# Altium project MB1635.PrjPcb (part 3 of 4)

## Sheet USB_TypeC_DRP.SchDoc: USB Type-C DRP
size A3; DocumentNumber: 13; Revision: A-01; SheetNumber: 13; SheetTotal: 17; Project: STM32MP15-BATTERY BOARD
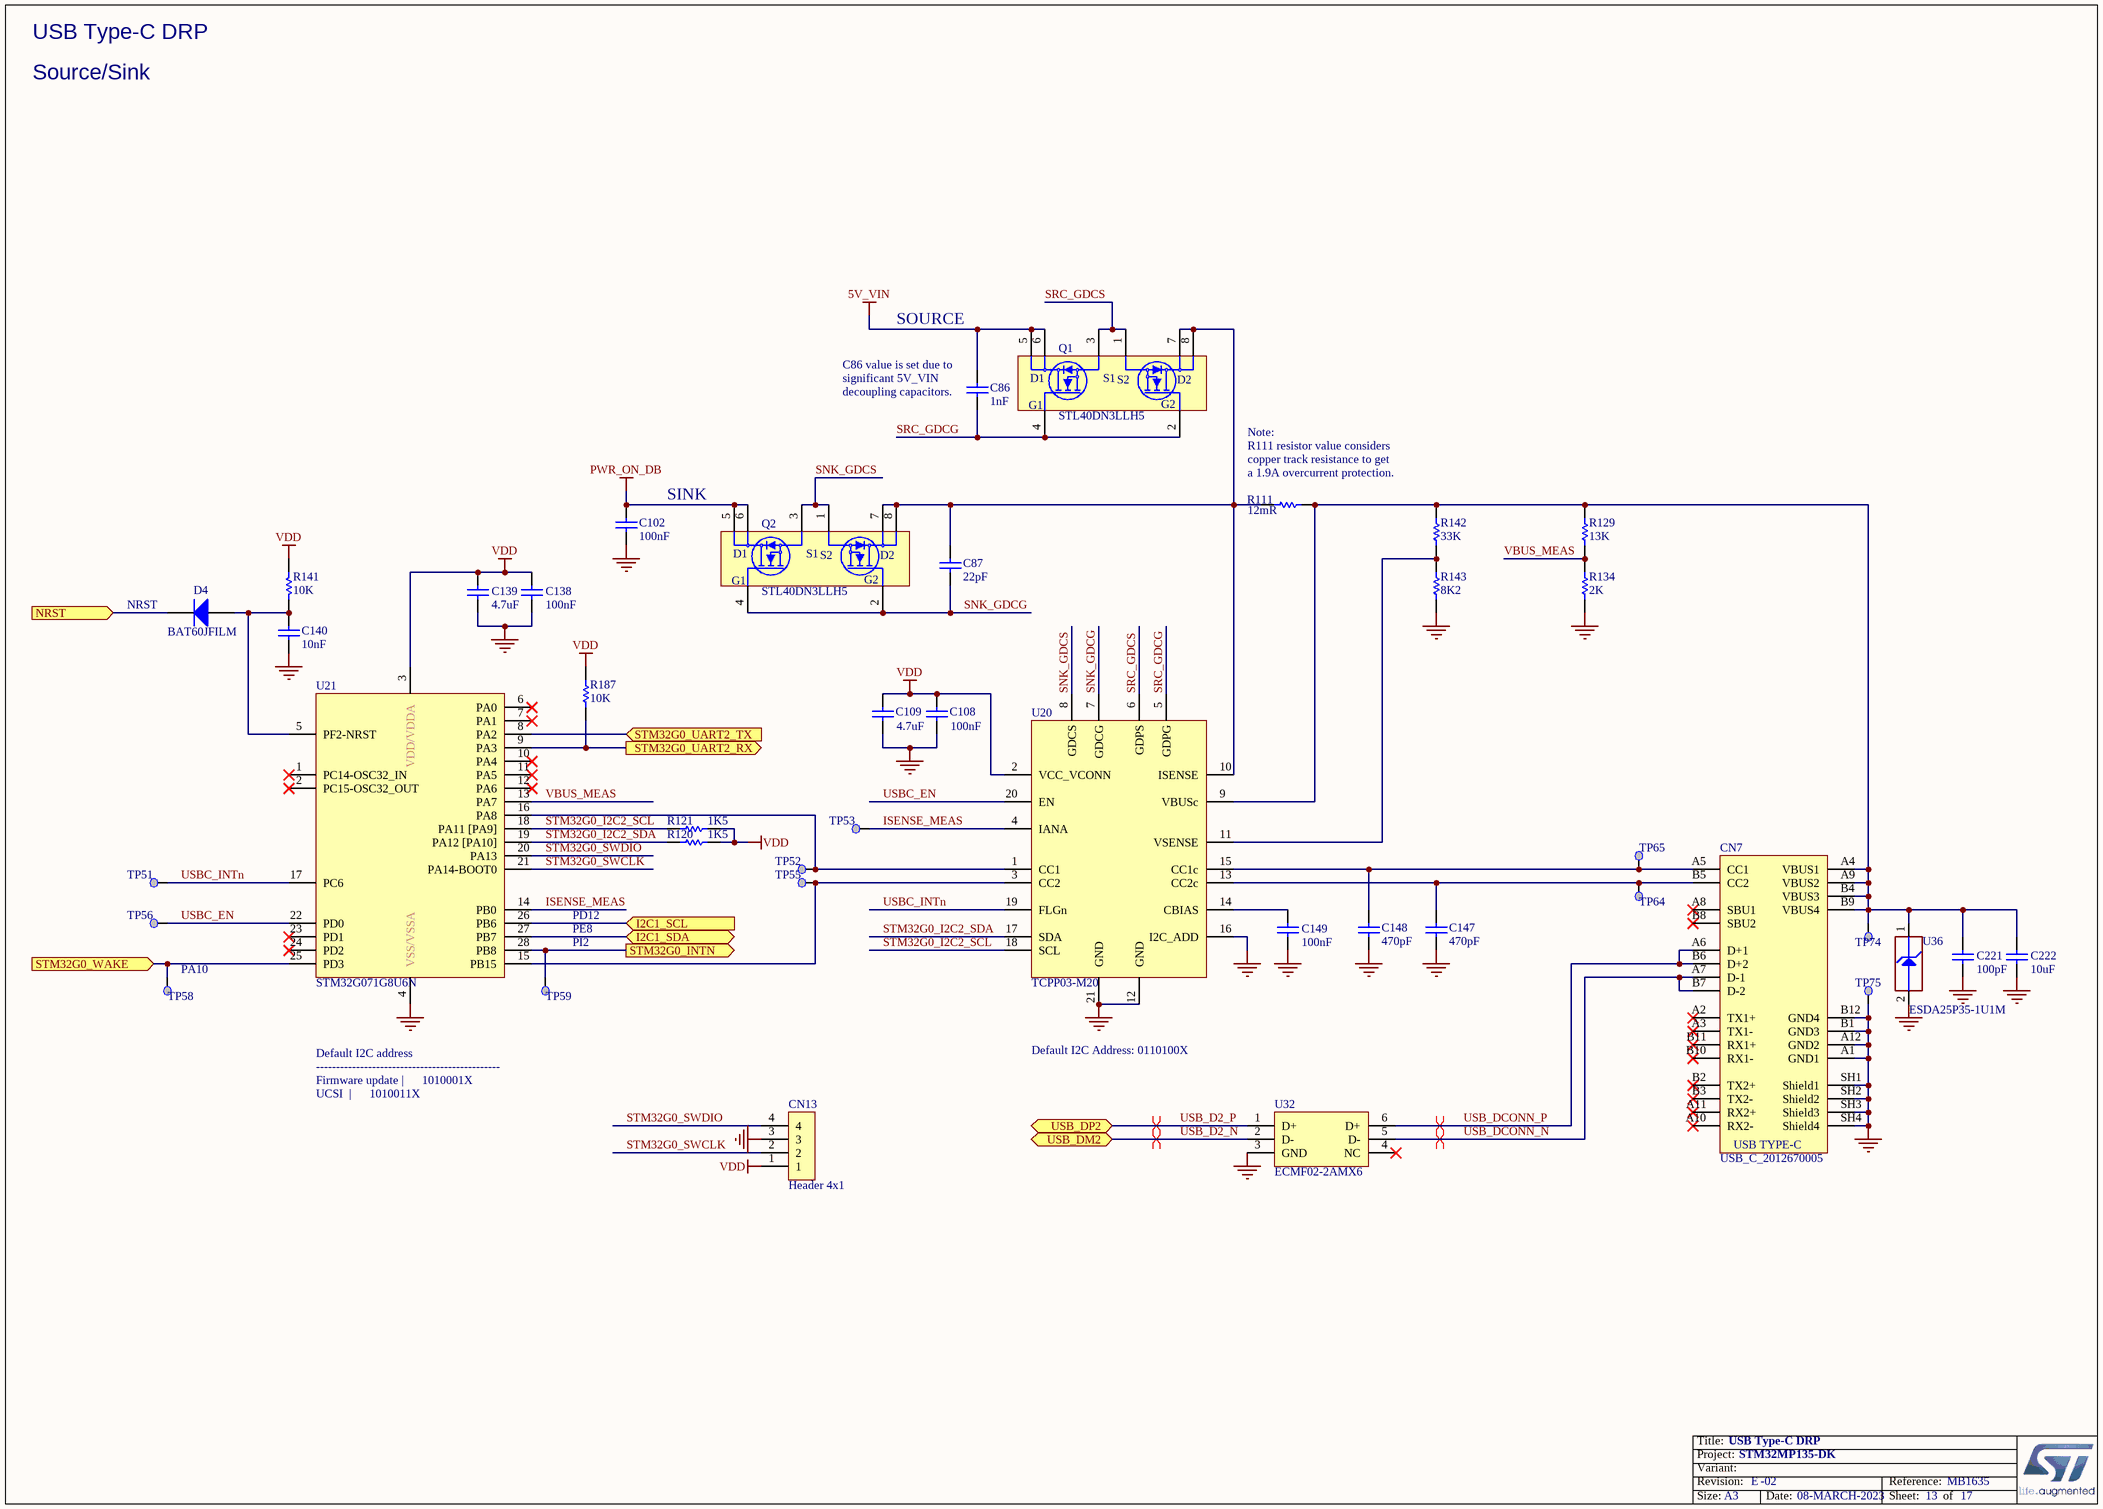
[diagram p5: USB_TypeC_DRP.SchDoc]

### Parts
C86  value 1nF  [C0402]  (hidden comment: Capacitor)
C87  value 22pF  [C0402]  (hidden comment: Capacitor)
C102  value 100nF  [C0402]  (hidden comment: Capacitor)
C108  value 100nF  [C0402]  (hidden comment: Capacitor)
C109  value 4.7uF  [C0402]  (hidden comment: Capacitor)
C138  value 100nF  [C0402]  (hidden comment: Capacitor)
C139  value 4.7uF  [C0402]  (hidden comment: Capacitor)
C140  value 10nF  [C0402]  (hidden comment: Capacitor)
C147  value 470pF  [C0402]  (hidden comment: Capacitor)
C148  value 470pF  [C0402]  (hidden comment: Capacitor)
C149  value 100nF  [C0603]  (hidden comment: Capacitor)
C221  value 100pF  [C0402]  (hidden comment: Capacitor)
C222  value 10uF  [C1210]  (hidden comment: Capacitor)
CN7  value USB_C_2012670005  [CON_USB-TYPEC_MOLEX_2012670005]  (hidden comment: USB_TYPE_C_Receptacle)
CN13  Header 4x1  [CON_SAMTEC_TSW-104-07-G-S]
D4  BAT60JFILM  [DIO_SOD323]
Q1  STL40DN3LLH5  [PowerFLAT_5x6]
Q2  STL40DN3LLH5  [PowerFLAT_5x6]
R111  value 12mR  [R0603_H070]  (hidden comment: Resistor)
R120  value 1K5  [R0402]  (hidden comment: Resistor)
R121  value 1K5  [R0402]  (hidden comment: Resistor)
R129  value 13K  [R0603]  (hidden comment: Resistor)
R134  value 2K  [R0603]  (hidden comment: Resistor)
R141  value 10K  [R0402]  (hidden comment: Resistor)
R142  value 33K  [R0603]  (hidden comment: Resistor)
R143  value 8K2  [R0603]  (hidden comment: Resistor)
R187  value 10K  [R0402]  (hidden comment: Resistor)
TP51  Test Point  [TP_SMD_1MM]  (value not drawn)  (no BOM)
TP52  Test Point  [TP_SMD_1MM]  (value not drawn)  (no BOM)
TP53  Test Point  [TP_SMD_1MM]  (value not drawn)  (no BOM)
TP55  Test Point  [TP_SMD_1MM]  (value not drawn)  (no BOM)
TP56  Test Point  [TP_SMD_1MM]  (value not drawn)  (no BOM)
TP58  Test Point  [TP_SMD_1MM]  (value not drawn)  (no BOM)
TP59  Test Point  [TP_SMD_1MM]  (value not drawn)  (no BOM)
TP64  Test Point  [TP_SMD_1MM]  (value not drawn)  (no BOM)
TP65  Test Point  [TP_SMD_1MM]  (value not drawn)  (no BOM)
TP74  Test Point  [TP_SMD_1MM]  (value not drawn)  (no BOM)
TP75  Test Point  [TP_SMD_1MM]  (value not drawn)  (no BOM)
U20  TCPP03-M20  [ICC_QFN20-EPAD_4X4_P050]
U21  STM32G071G8U6N  [ICC_UFQFPN28_4X4_P050]
U32  ECMF02-2AMX6  [ESD_QFN-6L_1P7X1P5_P050]
U36  value ESDA25P35-1U1M  [ESD_QFN1610_2N_1K_2A]  (hidden comment: ESD-TRANSIL)

### Ports
I2C1_SCL (in), I2C1_SDA (bidir), NRST (in), STM32G0_INTN (out), STM32G0_UART2_RX (out), STM32G0_UART2_TX (in), STM32G0_WAKE (in), USB_DM2 (bidir), USB_DP2 (bidir)

### Nets
5V_VIN: C86.2 Q1.5(D1) Q1.6(D1)
GND: C102.1 C108.1 C109.1 C138.1 C139.1 C140.1 C147.1 C148.1 C149.1 C221.1 C222.1 CN7.A1(GND1) CN7.A12(GND2) CN7.B1(GND3) CN7.B12(GND4) CN7.SH1(Shield1) CN7.SH2(Shield2) CN7.SH3(Shield3) CN7.SH4(Shield4) CN13.3 R134.1 R143.1 TP75.1 U20.12(GND) U20.16(I2C_ADD) U20.21(GND) U21.4(VSS/VSSA) U32.3(GND) U36.2(GND)
PWR_ON_DB: C102.2 Q2.5(D1) Q2.6(D1)
VDD: C108.2 C109.2 C138.2 C139.2 CN13.1 R120.2 R121.1 R141.2 R187.2 U20.2(VCC_VCONN) U21.3(VDD/VDDA)
I2C1_SCL: U21.26(PB6) ; port I2C1_SCL
I2C1_SDA: U21.27(PB7) ; port I2C1_SDA
ISENSE_MEAS: TP53.1 U20.4(IANA) U21.14(PB0)
NRST: D4.2(K) ; port NRST
SNK_GDCG: C87.1 Q2.2(G2) Q2.4(G1) U20.7(GDCG)
SNK_GDCS: Q2.1(S2) Q2.3(S1) U20.8(GDCS)
SRC_GDCG: C86.1 Q1.2(G2) Q1.4(G1) U20.5(GDPG)
SRC_GDCS: Q1.1(S2) Q1.3(S1) U20.6(GDPS)
STM32G0_I2C2_SCL: R121.2 U20.18(SCL) U21.18(PA11_[PA9])
STM32G0_I2C2_SDA: R120.1 U20.17(SDA) U21.19(PA12_[PA10])
STM32G0_INTN: TP59.1 U21.28(PB8) ; port STM32G0_INTN
STM32G0_SWCLK: CN13.2 U21.21(PA14-BOOT0)
STM32G0_SWDIO: CN13.4 U21.20(PA13)
STM32G0_UART2_RX: R187.1 U21.9(PA3) ; port STM32G0_UART2_RX
STM32G0_UART2_TX: U21.8(PA2) ; port STM32G0_UART2_TX
STM32G0_WAKE: TP58.1 U21.25(PD3) ; port STM32G0_WAKE
USB_D2_N: U32.2(D-) ; port USB_DM2
USB_D2_P: U32.1(D+) ; port USB_DP2
USB_DCONN_N: CN7.A7(D-1) CN7.B7(D-2) U32.5(D-)
USB_DCONN_P: CN7.A6(D+1) CN7.B6(D+2) U32.6(D+)
USBC_EN: TP56.1 U20.20(EN) U21.22(PD0)
USBC_INTn: TP51.1 U20.19(FLGn) U21.17(PC6)
VBUS_MEAS: R129.1 R134.2 U21.13(PA7)
NetC87_2: C87.2 Q1.7(D2) Q1.8(D2) Q2.7(D2) Q2.8(D2) R111.2 U20.10(ISENSE)
NetC140_2: C140.2 D4.1(A) R141.1 U21.5(PF2-NRST)
NetC147_2: C147.2 CN7.B5(CC2) TP64.1 U20.13(CC2c)
NetC148_2: C148.2 CN7.A5(CC1) TP65.1 U20.15(CC1c)
NetC149_2: C149.2 U20.14(CBIAS)
NetC221_2: C221.2 C222.2 CN7.A4(VBUS1) CN7.A9(VBUS2) CN7.B4(VBUS3) CN7.B9(VBUS4) R111.1 R129.2 R142.2 TP74.1 U20.9(VBUSc) U36.1(IO1)
NetR142_1: R142.1 R143.2 U20.11(VSENSE)
NetTP52_1: TP52.1 U20.1(CC1) U21.16(PA8)
NetTP55_1: TP55.1 U20.3(CC2) U21.15(PB15)

Not connected (* = marked no-connect by the designer): CN7 A2(TX1+)* A3(TX1-)* A8(SBU1)* A10(RX2-)* A11(RX2+)* B2(TX2+)* B3(TX2-)* B8(SBU2)* B10(RX1-)* B11(RX1+)*; U21 1(PC14-OSC32_IN)* 2(PC15-OSC32_OUT)* 6(PA0)* 7(PA1)* 10(PA4)* 11(PA5)* 12(PA6)* 23(PD1)* 24(PD2)*; U32 4(NC)*

### Layout directives
differential pair: USB_D2_N, USB_D2_P, USB_DCONN_N, USB_DCONN_P

### Notes on the sheet
- USB Type-C DRP
- Source/Sink
- SOURCE
- (near C86) C86 value is set due to significant 5V_VIN decoupling capacitors.
- SINK
- (near R111) Note:
  R111 resistor value considers copper track resistance to get a 1.9A overcurrent protection.
- (near D4) NRST
- PD12
- (near TP58) PA10
- PE8
- PI2
- Default I2C Address: 0110100X
- Default I2C address
  ----------------------------------------------
  Firmware update	|      1010001X
  UCSI		|      1010011X
- Title:
- Project:
- Size:
- Revision:
- Variant:
- A3
- -
- Date:
- Reference:
- Sheet:
- of
- (in symbol MCD-02421) USB TYPE-C

### Library data of the parts
C86 = MCD-00198: Capacitor, MLCC, 1nF, 16V, X7R, +/-10%, 0402, T=0.5mm; Part_Preference: Recommended; Manufacturer: YAGEO; Manufacturer_Part_Number: CC0402KRX7R7BB102; Component_Country_Of_Origin: China; ShowFields: YES; ID: 2665; Internal_Part_Number: MCD-00198; Status: Released; Part_Type: Capacitor; Package: 0402; ComponentLink1URL: http://tunmcdsvn.tun.st.com/Component_Documentation_Library/Trunk/Capacitor/YAGEO_X7R_Series; Order_Code_Digikey: 311-1352-1-ND; Order_Code_Farnell: 2370642; Order_Code_RS: N/A
C87 = MCD-01995: Capacitor, MLCC, 22pF, 50V, C0G, +/-5%, 0402, T=0.5mm; Part_Preference: Recommended; Manufacturer: TDK; Manufacturer_Part_Number: C1005NP01H220J050BA; Component_Country_Of_Origin: Unknown; ShowFields: YES; ID: 4095; Internal_Part_Number: MCD-01995; Status: Released; Part_Type: Capacitor; Package: 0402; ComponentLink1URL: http://tunmcdsvn.tun.st.com/Component_Documentation_Library/Trunk/Capacitor/TDK_C_Series; Order_Code_Digikey: 445-13793-1-ND; Order_Code_Farnell: 3416050RL; Order_Code_RS: N/A
C102 C108 C138 = MCD-00006: Capacitor, MLCC, 100nF, 16V, X7R, +/-10%, 0402, T=0.5mm; Part_Preference: Recommended; Manufacturer: YAGEO; Manufacturer_Part_Number: CC0402KRX7R7BB104; Order_Code_RS: 616-9701; Component_Country_Of_Origin: China; ShowFields: YES; ID: 2474; Internal_Part_Number: MCD-00006; Status: Released; Part_Type: Capacitor; Package: 0402; ComponentLink1URL: http://tunmcdsvn.tun.st.com/Component_Documentation_Library/Trunk/Capacitor/YAGEO_X7R_Series; Order_Code_Digikey: 311-1338-1-ND; Order_Code_Farnell: 9402047
C109 C139 = MCD-01356: Capacitor, MLCC, 4.7uF, 6V3, X5R, +/-20%, 0402, T=0.5mm; Part_Preference: Recommended; Manufacturer: MURATA; Manufacturer_Part_Number: GRM155R60J475ME47; Order_Code_RS: 814-5230; Component_Country_Of_Origin: Japan; ShowFields: YES; ID: 3456; Internal_Part_Number: MCD-01356; Status: Released; Part_Type: Capacitor; Package: 0402; ComponentLink1URL: http://tunmcdsvn.tun.st.com/Component_Documentation_Library/Trunk/Capacitor/MURATA_GRM_Series; Order_Code_Digikey: 490-5915-1-ND; Order_Code_Farnell: 2666407
C140 = MCD-02198: Capacitor, MLCC, 10nF, 50V, X7R, +/-10%, 0402, T=0.5mm; Part_Preference: Recommended; Manufacturer: YAGEO; Manufacturer_Part_Number: CC0402KRX7R9BB103; Order_Code_RS: 6169644; Component_Country_Of_Origin: China; ShowFields: YES; ID: 4298; Internal_Part_Number: MCD-02198; Status: Checked; Part_Type: Capacitor; Package: 0402; ComponentLink1URL: http://tunmcdsvn.tun.st.com/Component_Documentation_Library/Trunk/Capacitor/YAGEO_X7R_Series; Order_Code_Digikey: N/A; Order_Code_Farnell: N/A
C147 C148 = MCD-00724: Capacitor, MLCC, 470pF, 50V, NPO, +/-5%, 0402, T=0.5mm; Manufacturer_Part_Number: CC0402JRNPO9BN471; Manufacturer: YAGEO; Part_Preference: Recommended; Order_Code_RS: 199-2186; Component_Country_Of_Origin: China; ShowFields: YES; ID: 3023; Internal_Part_Number: MCD-00724; Status: Released; Part_Type: Capacitor; Package: 0402; ComponentLink1URL: http://tunmcdsvn.tun.st.com/Component_Documentation_Library/Trunk/Capacitor/YAGEO_NP0_Series; Order_Code_Digikey: 311-1671-1-ND; Order_Code_Farnell: 3366416
C149 = MCD-01099: Capacitor, MLCC, 100nF, 50V, X7R, +/-10%, 0603, T=0.8mm; BMS_Part_Number: 9142278; Part_Preference: Recommended; Manufacturer: YAGEO; Manufacturer_Part_Number: CC0603KRX7R9BB104; Order_Code_RS: 669-8767; Component_Country_Of_Origin: China; ShowFields: YES; ID: 3397; Internal_Part_Number: MCD-01099; Status: Released; Part_Type: Capacitor; Package: 0603; ComponentLink1URL: http://tunmcdsvn.tun.st.com/Component_Documentation_Library/Trunk/Capacitor/YAGEO_X7R_Series; Order_Code_Digikey: 311-1344-1-ND; Order_Code_Farnell: 1362556
C221 = MCD-00205: Capacitor, MLCC, 100pF, 50V, NPO, +/-5%, 0402, T=0.5mm; Manufacturer_Part_Number: CC0402JRNPO9BN101; Manufacturer: YAGEO; Part_Preference: Recommended; Component_Country_Of_Origin: China; ShowFields: YES; ID: 2658; Internal_Part_Number: MCD-00205; Status: Released; Part_Type: Capacitor; Package: 0402; ComponentLink1URL: http://tunmcdsvn.tun.st.com/Component_Documentation_Library/Trunk/Capacitor/YAGEO_NP0_Series; Order_Code_Digikey: 311-1024-1-ND; Order_Code_Farnell: 3019226RL; Order_Code_RS: N/A
C222 = MCD-02378: Capacitor, MLCC, 10uF, 50V, X7R, +/-10%, 1210, T=2.5mm; Manufacturer_Part_Number: C3225X7R1H106K250AC; Manufacturer: TDK; Part_Preference: Recommended; Component_Country_Of_Origin: Japan; ShowFields: YES; ID: 4484; Internal_Part_Number: MCD-02378; Status: Checked; Part_Type: Capacitor; Package: 1210; ComponentLink1URL: http://tunmcdsvn.tun.st.com/Component_Documentation_Library/Trunk/Capacitor/TDK_C_Series/; Order_Code_Digikey: 445-C3225X7R1H106K250ACTR-ND; Order_Code_Farnell: 3416257; Order_Code_RS: N/A
CN7 = MCD-02421: USB_TypeC, 24 pins, RA, SMD, T=3.71mm (USB Certified 3.1); Part_Type: Connector; Manufacturer_Part_Number: 2012670005; Manufacturer: MOLEX; Part_Preference: Recommended; Order_Code_RS: 176-8434; Component_Country_Of_Origin: Unknown; ShowFields: YES; ID: 4527; Internal_Part_Number: MCD-02421; Status: Released; ComponentLink1URL: http://tunmcdsvn.tun.st.com/Component_Documentation_Library/Trunk/Connector/MOLEX_201267_Series; Order_Code_Digikey: WM17992TR-ND; Order_Code_Farnell: 2990523
CN13 = MCD-00029: Header, 4x1, 2.54mm, VR, TH, T=5.84mm/2.54mm; Part_Type: Connector; Manufacturer_Part_Number: TSW-104-07-G-S; Manufacturer: SAMTEC; Part_Preference: Recommended; Order_Code_RS: 161-2261; Component_Country_Of_Origin: China, Costa Rica, Malaysia, United States, Vietnam; ShowFields: YES; ID: 2487; Internal_Part_Number: MCD-00029; Value: Header 4x1; Status: Released; ComponentLink1URL: http://tunmcdsvn.tun.st.com/Component_Documentation_Library/Trunk/Connector/SAMTEC_TSW_Series/; Order_Code_Digikey: TSW-104-07-G-S-ND; Order_Code_Farnell: 2667450
D4 = MCD-00034: BMS_Part_Number: 9151097; Part_Preference: Recommended; Part_Type: Diode; Manufacturer: STMICROELECTRONICS; Manufacturer_HQ_COO: EU; Component_Country_Of_Origin: China; ShowFields: YES; ID: 2483; Internal_Part_Number: MCD-00034; Value: BAT60JFILM; Status: Released; Manufacturer_Part_Number: BAT60JFILM; ComponentLink1URL: http://tunmcdsvn.tun.st.com/Component_Datasheet_Library/Trunk/Diodes/STM_Diode_BAT60JFILM-SOD323
Q1 Q2 = MCD-02152: MOSFET, Dual N-channel 30 V, 0.016 Ω typ., 40 A, STripFET™ H5 Power MOSFET; Part_Preference: Recommended; Part_Type: Transistor; Manufacturer: STMICROELECTRONICS; Manufacturer_HQ_COO: EU; Component_Country_Of_Origin: China; ShowFields: YES; ID: 4252; Internal_Part_Number: MCD-02152; Value: STL40DN3LLH5; Status: Released; Manufacturer_Part_Number: STL40DN3LLH5; Package: PowerFLAT 5x6; ComponentLink1URL: http://tunmcdsvn.tun.st.com/Component_Datasheet_Library/Trunk/Transistors/STMICROELECTRONICS_STL40DN3LLH5; Order_Code_Digikey: N/A; Order_Code_Farnell: N/A; Order_Code_RS: N/A
R111 = MCD-03129: Resistor, 12mR, 0603, +/-1%, 1/2W; Part_Preference: Recommended; Manufacturer: VISHAY; Manufacturer_Part_Number: WFCP0603R0120FE66; ShowFields: YES; ID: 5245; Component_Country_Of_Origin: Taiwan°; Internal_Part_Number: MCD-03129; Status: New; Part_Type: Resistor; ComponentLink1URL: http://tunmcdsvn.tun.st.com/Component_Documentation_Library/Trunk/Resistor/VISHAY_WFCP_Series; Order_Code_Digikey: 541-WFCP0603R0120FE66TR-ND; Order_Code_Farnell: 3954016RL; Order_Code_RS: N/A; Package: 0603
R120 R121 = MCD-00068: Resistor, 1K5, 0402, +/-1%, 1/16W; Part_Preference: Recommended; Manufacturer: YAGEO; Manufacturer_Part_Number: RC0402FR-071K5L; Component_Country_Of_Origin: China; ShowFields: YES; ID: 2524; Internal_Part_Number: MCD-00068; Status: Released; Part_Type: Resistor; Package: 0402; ComponentLink1URL: http://tunmcdsvn.tun.st.com/Component_Documentation_Library/Trunk/Resistor/YAGEO_RC_L_Series; Order_Code_Digikey: 311-1.50KLRCT-ND; Order_Code_Farnell: 9239251; Order_Code_RS: N/A
R129 = MCD-00384: Resistor, 13K, 0603,+/-1%, 1/10W; Part_Preference: Recommended; Manufacturer: YAGEO; Manufacturer_Part_Number: RC0603FR-0713KL; Component_Country_Of_Origin: China; ShowFields: YES; ID: 2894; Internal_Part_Number: MCD-00384; Status: Released; Part_Type: Resistor; Package: 0603; ComponentLink1URL: http://tunmcdsvn.tun.st.com/Component_Documentation_Library/Trunk/Resistor/YAGEO_RC_L_Series; Order_Code_Digikey: 311-13.0KHRCT-ND; Order_Code_Farnell: 1799325; Order_Code_RS: N/A
R134 = MCD-00420: Resistor, 2K ,0603, +/-1%, 1/10W; Part_Preference: Recommended; Manufacturer: YAGEO; Manufacturer_Part_Number: RC0603FR-072KL; Component_Country_Of_Origin: China; ShowFields: YES; ID: 2857; Internal_Part_Number: MCD-00420; Status: Released; Part_Type: Resistor; Package: 0603; ComponentLink1URL: http://tunmcdsvn.tun.st.com/Component_Documentation_Library/Trunk/Resistor/YAGEO_RC_L_Series; Order_Code_Digikey: 311-2.00KHRCT-ND; Order_Code_Farnell: 1799328; Order_Code_RS: N/A
R141 = MCD-00053: Resistor, 10K, 0402, +/-1%, 1/16W; BMS_Part_Number: 9131590; Part_Preference: Recommended; Manufacturer: YAGEO; Manufacturer_Part_Number: RC0402FR-0710KL; Component_Country_Of_Origin: China; ShowFields: YES; ID: 2539; Internal_Part_Number: MCD-00053; Status: Released; Part_Type: Resistor; Package: 0402; ComponentLink1URL: http://tunmcdsvn.tun.st.com/Component_Documentation_Library/Trunk/Resistor/YAGEO_RC_L_Series; Order_Code_Digikey: 311-10.0KLRCT-ND; Order_Code_Farnell: 9239359; Order_Code_RS: N/A
R142 = MCD-00259: Resistor, 33K, 0603, +/-1%, 1/10W; BMS_Part_Number: 9129771; Part_Preference: Recommended; Manufacturer: YAGEO; Manufacturer_Part_Number: RC0603FR-0733KL; Component_Country_Of_Origin: China; ShowFields: YES; ID: 2610; Internal_Part_Number: MCD-00259; Status: Released; Part_Type: Resistor; Package: 0603; ComponentLink1URL: http://tunmcdsvn.tun.st.com/Component_Documentation_Library/Trunk/Resistor/YAGEO_RC_L_Series; Order_Code_Digikey: 311-33.0KHRCT-ND; Order_Code_Farnell: 9238662; Order_Code_RS: N/A
R143 = MCD-00530: Resistor, 8K2, 0603, +/-1%, 1/10W; Part_Preference: Recommended; Manufacturer: YAGEO; Manufacturer_Part_Number: RC0603FR-078K2L; Component_Country_Of_Origin: China; ShowFields: YES; ID: 3212; Internal_Part_Number: MCD-00530; Status: Released; Part_Type: Resistor; Package: 0603; ComponentLink1URL: http://tunmcdsvn.tun.st.com/Component_Documentation_Library/Trunk/Resistor/YAGEO_RC_L_Series; Order_Code_Digikey: 311-8.20KHRCT-ND; Order_Code_Farnell: 9238590; Order_Code_RS: N/A
R187 = MCD-00053: Resistor, 10K, 0402, +/-1%, 1/16W; Manufacturer_Part_Number: RC0402FR-0710KL; Manufacturer: YAGEO; BMS_Part_Number: 9131590; Part_Preference: Recommended; Component_Country_Of_Origin: China; ShowFields: YES; ID: 2539; Internal_Part_Number: MCD-00053; Status: Released; Part_Type: Resistor; Package: 0402; ComponentLink1URL: http://tunmcdsvn.tun.st.com/Component_Documentation_Library/Trunk/Resistor/YAGEO_RC_L_Series; Order_Code_Digikey: 311-10.0KLRCT-ND; Order_Code_Farnell: 9239359; Order_Code_RS: N/A
TP51-TP53 TP55 TP56 TP58 TP59 TP64 TP65 TP74 TP75 = MCD-00074: Test Point 1mm; Part_Type: Misc; Part_Preference: Recommended; ShowFields: YES; ID: 2518; Internal_Part_Number: MCD-00074; Status: Released; Manufacturer_Part_Number: N/A; Manufacturer: N/A; ComponentLink1URL: http://na; Order_Code_Digikey: N/A; Order_Code_Farnell: N/A; Order_Code_RS: N/A
U20 = MCD-02130: USB Type-C Port Protection for USB DRP Power Delivery, PPS compliant; Part_Preference: Recommended; Part_Type: IC; Manufacturer: STMICROELECTRONICS; Manufacturer_HQ_COO: EU; Component_Country_Of_Origin: Unknown; ShowFields: YES; ID: 4230; Internal_Part_Number: MCD-02130; Value: TCPP03-M20; Status: Released; Manufacturer_Part_Number: TCPP03-M20; Package: QFN-20L; ComponentLink1URL: http://tunmcdsvn.tun.st.com/Component_Documentation_Library/Trunk/IC/STMICROELECTRONICS_TCPP03-M20; Order_Code_Digikey: N/A; Order_Code_Farnell: N/A; Order_Code_RS: N/A
U21 = MCD-02218: Arm Cortex-M0+ 32-bit MCU, up to 128 KB Flash, 36 KB RAM,  4x USART, timers, ADC, DAC, comm. I/Fs, 1.7-3.6V; Part_Preference: Recommended; Part_Type: IC; Manufacturer: STMICROELECTRONICS; Manufacturer_HQ_COO: EU; Order_Code_RS: NA; Component_Country_Of_Origin: China; ShowFields: YES; ID: 4318; Status: Checked; ComponentLink1URL: http://tunmcdsvn.tun.st.com/Component_Datasheet_Library/Trunk/IC/STM_MCU_STM32G071G8U6N; Internal_Part_Number: MCD-02218; Manufacturer_Part_Number: STM32G071G8U6N; Package: UFQFPN28; Order_Code_Digikey: STM32G071G8U6N-ND; Order_Code_Farnell: 3011626; Value: STM32G071G8U6N
U32 = MCD-00649: Common mode filter with ESD protection for USB 2.0 interface; Part_Type: Diode; Manufacturer: STMICROELECTRONICS; BMS_Part_Number: 9151138; Part_Preference: Recommended; Manufacturer_HQ_COO: EU; Component_Country_Of_Origin: China; ShowFields: YES; ID: 3094; Internal_Part_Number: MCD-00649; Value: ECMF02-2AMX6; Status: Released; Manufacturer_Part_Number: ECMF02-2AMX6; ComponentLink1URL: http://tunmcdsvn.tun.st.com/Component_Datasheet_Library/Trunk/Diodes/STM_ESD_ECMF02-2AMX6
U36 = MCD-01207: High power Transient voltage suppressor:25V/35A EOS and ESD transients protection.; Part_Type: Diode; Manufacturer: STMICROELECTRONICS; Part_Preference: Recommended; Manufacturer_HQ_COO: EU; BMS_Part_Number: 9179045; Component_Country_Of_Origin: China; ShowFields: YES; ID: 3289; Internal_Part_Number: MCD-01207; Status: Released; Manufacturer_Part_Number: ESDA25P35-1U1M; Package: QFN1610; ComponentLink1URL: http://tunmcdsvn.tun.st.com/Component_Datasheet_Library/Trunk/Diodes/STM_ESD_ESDA25P35-1U1M

## Sheet Expansion_Connector.SchDoc: Expansion connector
size A4; Project: STM32MP15-DISCO PI; Date: Not used; ApprovedBy: Not used; CheckedBy: Not used; Author: Not used; CompanyName: STMicroelectronics; DrawnBy: Not used; Engineer: Not used; Organization: Not used; Address1: Not used; Address2: Not used; Address3: Not used; Address4: Not used; DocumentNumber: 14; Revision: Not used; SheetNumber: 14; SheetTotal: 17; CurrentTime: Not used; CurrentDate: Not used; Time: Not used; DocumentFullPathAndName: Not used; DocumentName: Not used; ModifiedDate: Not used; ImagePath: Not used; ProjectName: Not used; Application_BuildNumber: Not used
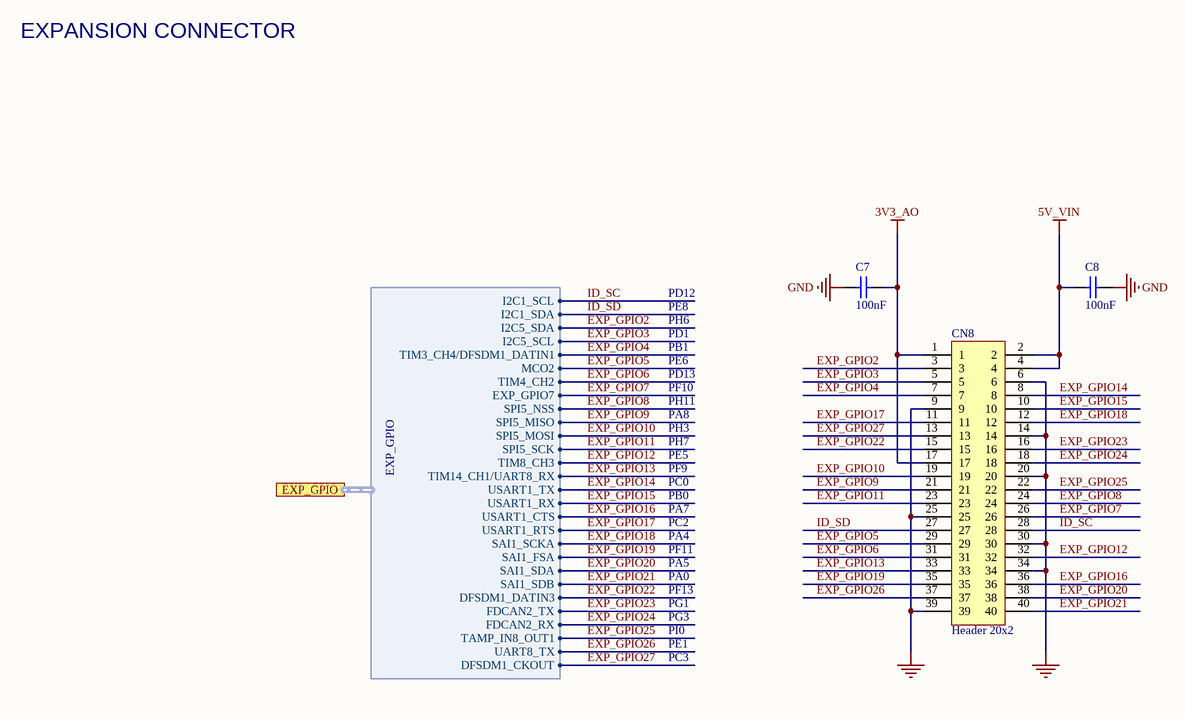
[diagram p6: Expansion_Connector.SchDoc]

### Parts
C7  value 100nF  [C0402]  (hidden comment: Capacitor)
C8  value 100nF  [C0402]  (hidden comment: Capacitor)
CN8  Header 20x2  [CON_SAMTEC_TSW-120-07-G-D]

### Ports
EXP_GPIO (harness EXP_GPIO)

### Harnesses
EXP_GPIO: I2C1_SCL, I2C1_SDA, I2C5_SDA, MCO2, TIM8_CH3, DFSDM1_DATIN3, SPI5_NSS, SPI5_MISO, SPI5_MOSI, SPI5_SCK, TIM4_CH2, USART1_TX, USART1_RX, USART1_CTS, USART1_RTS, UART8_TX, TIM14_CH1/UART8_RX, FDCAN2_TX, FDCAN2_RX, DFSDM1_CKOUT, TIM3_CH4/DFSDM1_DATIN1, I2C5_SCL, SAI1_SCKA, SAI1_FSA, SAI1_SDA, SAI1_SDB, TAMP_IN8_OUT1, EXP_GPIO7

### Nets
3V3_AO: C7.1 CN8.1 CN8.17
5V_VIN: C8.2 CN8.2 CN8.4
GND: C7.2 C8.1 CN8.6 CN8.9 CN8.14 CN8.20 CN8.25 CN8.30 CN8.34 CN8.39
EXP_GPIO2: CN8.3 ; port EXP_GPIO.I2C5_SDA
EXP_GPIO3: CN8.5 ; port EXP_GPIO.I2C5_SCL
EXP_GPIO4: CN8.7 ; port EXP_GPIO.TIM3_CH4/DFSDM1_DATIN1
EXP_GPIO5: CN8.29 ; port EXP_GPIO.MCO2
EXP_GPIO6: CN8.31 ; port EXP_GPIO.TIM4_CH2
EXP_GPIO7: CN8.26 ; port EXP_GPIO.EXP_GPIO7
EXP_GPIO8: CN8.24 ; port EXP_GPIO.SPI5_NSS
EXP_GPIO9: CN8.21 ; port EXP_GPIO.SPI5_MISO
EXP_GPIO10: CN8.19 ; port EXP_GPIO.SPI5_MOSI
EXP_GPIO11: CN8.23 ; port EXP_GPIO.SPI5_SCK
EXP_GPIO12: CN8.32 ; port EXP_GPIO.TIM8_CH3
EXP_GPIO13: CN8.33 ; port EXP_GPIO.TIM14_CH1/UART8_RX
EXP_GPIO14: CN8.8 ; port EXP_GPIO.USART1_TX
EXP_GPIO15: CN8.10 ; port EXP_GPIO.USART1_RX
EXP_GPIO16: CN8.36 ; port EXP_GPIO.USART1_CTS
EXP_GPIO17: CN8.11 ; port EXP_GPIO.USART1_RTS
EXP_GPIO18: CN8.12 ; port EXP_GPIO.SAI1_SCKA
EXP_GPIO19: CN8.35 ; port EXP_GPIO.SAI1_FSA
EXP_GPIO20: CN8.38 ; port EXP_GPIO.SAI1_SDA
EXP_GPIO21: CN8.40 ; port EXP_GPIO.SAI1_SDB
EXP_GPIO22: CN8.15 ; port EXP_GPIO.DFSDM1_DATIN3  [project net DFSDM1_DATIN3]
EXP_GPIO23: CN8.16 ; port EXP_GPIO.FDCAN2_TX
EXP_GPIO24: CN8.18 ; port EXP_GPIO.FDCAN2_RX
EXP_GPIO25: CN8.22 ; port EXP_GPIO.TAMP_IN8_OUT1
EXP_GPIO26: CN8.37 ; port EXP_GPIO.UART8_TX
EXP_GPIO27: CN8.13 ; port EXP_GPIO.DFSDM1_CKOUT  [project net DFSDM1_CKOUT]
ID_SC: CN8.28 ; port EXP_GPIO.I2C1_SCL  [project net I2C1_SCL]
ID_SD: CN8.27 ; port EXP_GPIO.I2C1_SDA  [project net I2C1_SDA]

### Notes on the sheet
- EXPANSION CONNECTOR
- PD12
- PE8
- PB1
- PD1
- PH6
- PE6
- PD13
- PF10
- PA8
- PH3
- PH7
- PH11
- PE5
- PF9
- PA7
- PC0
- PB0
- PF11
- PA4
- PA5
- PA0
- PC2
- PF13
- PG3
- PG1
- PI0
- PE1
- PC3
- Title:
- Project:
- Size:
- Revision:
- Variant:
- A4
- -
- Date:
- Reference:
- Sheet:
- of

### Library data of the parts
C7 C8 = MCD-00006: as C102 on sheet USB_TypeC_DRP; Internal_Part_Number: MCD-00006; Status: Released; Part_Type: Capacitor; Package: 0402; ComponentLink1URL: http://tunmcdsvn.tun.st.com/Component_Documentation_Library/Trunk/Capacitor/YAGEO_X7R_Series; Order_Code_Digikey: 311-1338-1-ND; Order_Code_Farnell: 9402047
CN8 = MCD-00302: Header, 20x2, 2.54mm, VR, TH, T=5.84mm/2.54mm; Manufacturer_Part_Number: TSW-120-07-G-D; Manufacturer: SAMTEC; Part_Type: Connector; Part_Preference: Recommended; Order_Code_RS: 180-2456; Component_Country_Of_Origin: China, Costa Rica, Malaysia, United States, Vietnam; ShowFields: YES; ID: 2567; Internal_Part_Number: MCD-00302; Value: Header 20x2; ComponentLink1URL: http://tunmcdsvn.tun.st.com/Component_Documentation_Library/Trunk/Connector/SAMTEC_TSW_Series/; Status: Released; Order_Code_Digikey: SAM1028-20-ND; Order_Code_Farnell: 2779689

## Sheet MCP_IO_expander.SchDoc: IO expander
size A4; Project: STM32MP15x-EVAL; Date: Not used; ApprovedBy: Not used; CheckedBy: Not used; Author: Not used; CompanyName: STMicroelectronics; DrawnBy: Not used; Engineer: Not used; Organization: Not used; Address1: Not used; Address2: Not used; Address3: Not used; Address4: Not used; DocumentNumber: 16; Revision: Not used; SheetNumber: 16; SheetTotal: 17; CurrentTime: Not used; CurrentDate: Not used; Time: Not used; DocumentFullPathAndName: Not used; DocumentName: Not used; ModifiedDate: Not used; ImagePath: Not used; ProjectName: Not used; Application_BuildNumber: Not used
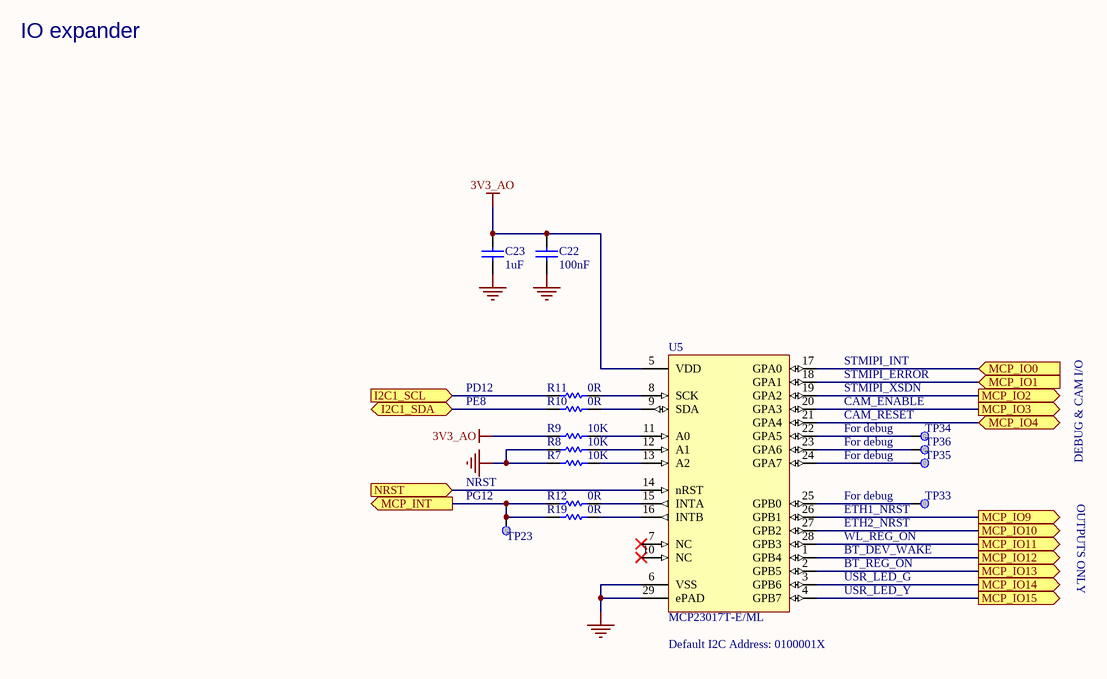
[diagram p7: MCP_IO_expander.SchDoc]

### Parts
C22  value 100nF  [C0402]  (hidden comment: Capacitor)
C23  value 1uF  [C0201_MURATA_GRM033_H0P3]  (hidden comment: Capacitor)
R7  value 10K  [R0402]  (hidden comment: Resistor)
R8  value 10K  [R0402]  (hidden comment: Resistor)
R9  value 10K  [R0402]  (hidden comment: Resistor)
R10  value 0R  [R0402]  (hidden comment: Resistor)
R11  value 0R  [R0402]  (hidden comment: Resistor)
R12  value 0R  [R0402]  (hidden comment: Resistor)
R19  value 0R  [R0402]  (hidden comment: Resistor)
TP23  Test Point  [TP_SMD_1MM]  (value not drawn)  (no BOM)
TP33  Test Point  [TP_SMD_1MM]  (value not drawn)  (no BOM)
TP34  Test Point  [TP_SMD_1MM]  (value not drawn)  (no BOM)
TP35  Test Point  [TP_SMD_1MM]  (value not drawn)  (no BOM)
TP36  Test Point  [TP_SMD_1MM]  (value not drawn)  (no BOM)
U5  value MCP23017T-E/ML  [ICC_QFN28-EPAD_6X6_P065]  (hidden comment: MCP23017)

### Ports
I2C1_SCL (in), I2C1_SDA (bidir), MCP_INT (out), MCP_IO0 (in), MCP_IO1 (in), MCP_IO2 (out), MCP_IO3 (out), MCP_IO4 (bidir), MCP_IO9 (out), MCP_IO10 (out), MCP_IO11 (out), MCP_IO12 (out), MCP_IO13 (out), MCP_IO14 (out), MCP_IO15 (out), NRST (in)

### Nets
3V3_AO: C22.2 C23.2 R9.1 U5.5(VDD)
GND: C22.1 C23.1 R7.1 R8.1 U5.6(VSS) U5.29(ePAD)
I2C1_SCL: R11.1 ; port I2C1_SCL
I2C1_SDA: R10.1 ; port I2C1_SDA
MCP_INT: R12.1 R19.1 TP23.1 ; port MCP_INT
MCP_IO0: U5.17(GPA0) ; port MCP_IO0
MCP_IO1: U5.18(GPA1) ; port MCP_IO1
MCP_IO2: U5.19(GPA2) ; port MCP_IO2
MCP_IO3: U5.20(GPA3) ; port MCP_IO3
MCP_IO4: U5.21(GPA4) ; port MCP_IO4
MCP_IO9: U5.26(GPB1) ; port MCP_IO9
MCP_IO10: U5.27(GPB2) ; port MCP_IO10
MCP_IO11: U5.28(GPB3) ; port MCP_IO11
MCP_IO12: U5.1(GPB4) ; port MCP_IO12
MCP_IO13: U5.2(GPB5) ; port MCP_IO13
MCP_IO14: U5.3(GPB6) ; port MCP_IO14
MCP_IO15: U5.4(GPB7) ; port MCP_IO15
NRST: U5.14(nRST) ; port NRST
NetR7_2: R7.2 U5.13(A2)
NetR8_2: R8.2 U5.12(A1)
NetR9_2: R9.2 U5.11(A0)
NetR10_2: R10.2 U5.9(SDA)
NetR11_2: R11.2 U5.8(SCK)
NetR12_2: R12.2 U5.15(INTA)
NetR19_2: R19.2 U5.16(INTB)
NetTP33_1: TP33.1 U5.25(GPB0)
NetTP34_1: TP34.1 U5.22(GPA5)
NetTP35_1: TP35.1 U5.24(GPA7)
NetTP36_1: TP36.1 U5.23(GPA6)

Not connected (* = marked no-connect by the designer): U5 7(NC)* 10(NC)*

### Notes on the sheet
- IO expander
- STMIPI_INT
- STMIPI_ERROR
- PD12
- PE8
- CAM_RESET
- For debug
- CAM_ENABLE
- STMIPI_XSDN
- (near TP23) PG12
- (near TP23) NRST
- (near TP33) ETH1_NRST
- OUTPUTS ONLY
- DEBUG & CAM I/O
- BT_DEV_WAKE
- BT_REG_ON
- (near TP33) ETH2_NRST
- WL_REG_ON
- USR_LED_G
- (near U5) Default I2C Address: 0100001X
- USR_LED_Y
- Title:
- Project:
- Size:
- Revision:
- Variant:
- A4
- -
- Date:
- Reference:
- Sheet:
- of

### Library data of the parts
C22 = MCD-00006: as C102 on sheet USB_TypeC_DRP; Internal_Part_Number: MCD-00006; Status: Released; Part_Type: Capacitor; Package: 0402; ComponentLink1URL: http://tunmcdsvn.tun.st.com/Component_Documentation_Library/Trunk/Capacitor/YAGEO_X7R_Series; Order_Code_Digikey: 311-1338-1-ND; Order_Code_Farnell: 9402047
C23 = MCD-02377: Capacitor, MLCC, 1uF, 6.3V, X5R, +/-20%, 0201, T=0,3mm; Part_Preference: Recommended; Manufacturer: MURATA; Manufacturer_Part_Number: GRM033R60J105MEA2; Order_Code_RS: 820-0643; Component_Country_Of_Origin: Japan; ShowFields: YES; ID: 4483; Internal_Part_Number: MCD-02377; Status: Checked; Part_Type: Capacitor; Package: 0201; ComponentLink1URL: http://tunmcdsvn.tun.st.com/Component_Documentation_Library/Trunk/Capacitor/MURATA_GRM_Series/GRM033R60J105MEA2/; Order_Code_Digikey: 490-7229-2-ND; Order_Code_Farnell: 2470448
R7-R9 = MCD-00053: as R141 on sheet USB_TypeC_DRP; Internal_Part_Number: MCD-00053; Status: Released; Part_Type: Resistor; Package: 0402; ComponentLink1URL: http://tunmcdsvn.tun.st.com/Component_Documentation_Library/Trunk/Resistor/YAGEO_RC_L_Series; Order_Code_Digikey: 311-10.0KLRCT-ND; Order_Code_Farnell: 9239359; Order_Code_RS: N/A
R10-R12 R19 = MCD-00052: Resistor, 0R, 0402, +/-5%, 1/16W; Part_Preference: Recommended; Manufacturer: YAGEO; Manufacturer_Part_Number: RC0402JR-070RL; Order_Code_RS: 618-5804; Component_Country_Of_Origin: China; ShowFields: YES; ID: 2540; Internal_Part_Number: MCD-00052; Status: Released; Part_Type: Resistor; Package: 0402; ComponentLink1URL: http://tunmcdsvn.tun.st.com/Component_Documentation_Library/Trunk/Resistor/YAGEO_RC_L_Series; Order_Code_Digikey: 311-0.0JRCT-ND; Order_Code_Farnell: 9232516RL
TP23 TP33-TP36 = MCD-00074: as TP51 on sheet USB_TypeC_DRP; Internal_Part_Number: MCD-00074; Status: Released; ComponentLink1URL: http://na; Manufacturer: N/A; Manufacturer_Part_Number: N/A; Order_Code_Digikey: N/A; Order_Code_Farnell: N/A; Order_Code_RS: N/A
U5 = MCD-02210: 16-bit port expander with I2C control; Part_Preference: Recommended; Part_Type: IC; Manufacturer: MICROCHIP; Order_code_RS: 177-2846; Component_Country_Of_Origin: Unknown; ShowFields: YES; ID: 4310; Order_code_Digikey: MCP23017T-E/MLTR-ND; Order_code_Farnell: 2857786; Status: Released; ComponentLink1URL: http://tunmcdsvn.tun.st.com/Component_Datasheet_Library/Trunk/IC/MICROCHIP_IOexpander_MCP23017; Internal_Part_Number: MCD-02210; Manufacturer_Part_Number: MCP23017T-E/ML; Package: QFN28 6x6mm

## Sheet ST-Link_V3E.SchDoc: ST-LINK V3E
size A3; Project: STLink V3 Embedded Prototype; BOM Version: A-01; Date: Not used; ApprovedBy: Not used; CheckedBy: Not used; Author: Not used; CompanyName: STMicroelectronics; DrawnBy: Not used; Engineer: Not used; Organization: Not used; Address1: Not used; Address2: Not used; Address3: Not used; Address4: Not used; DocumentNumber: 17; Revision: Not used; SheetNumber: 17; SheetTotal: 17; CurrentTime: Not used; CurrentDate: Not used; Time: Not used; DocumentFullPathAndName: Not used; DocumentName: Not used; ModifiedDate: Not used; ImagePath: Not used; ProjectName: Not used; Application_BuildNumber: Not used
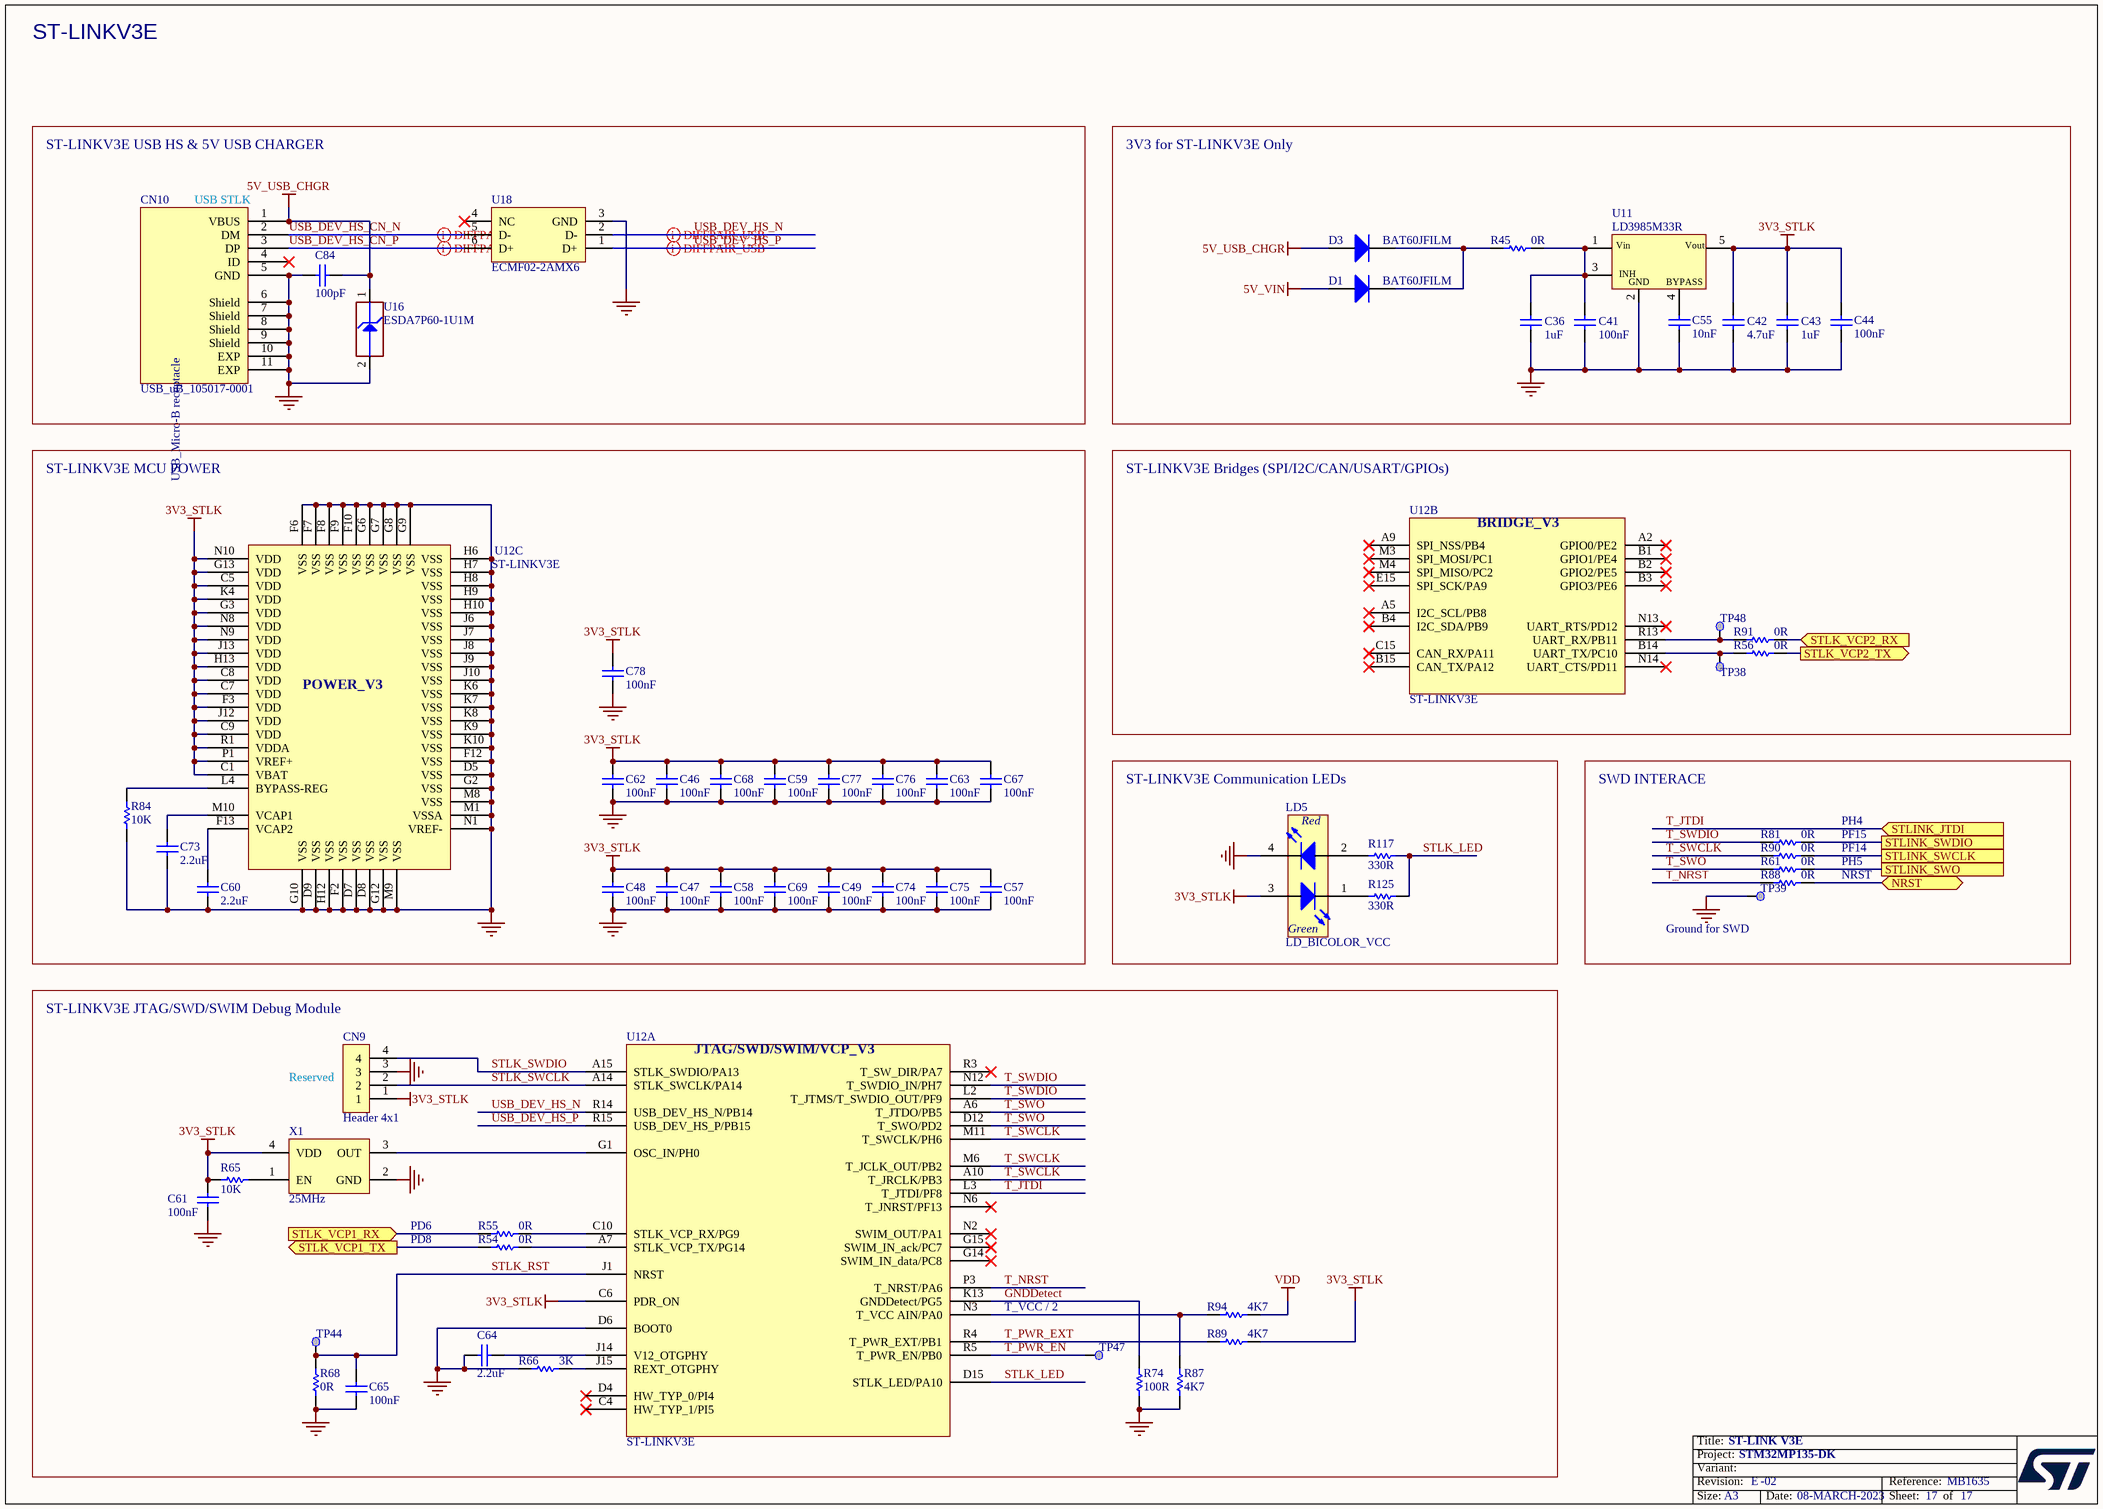
[diagram p8: ST-Link_V3E.SchDoc]

### Parts
C36  value 1uF  [C0402]  (hidden comment: Capacitor)
C41  value 100nF  [C0402]  (hidden comment: Capacitor)
C42  value 4.7uF  [C0402]  (hidden comment: Capacitor)
C43  value 1uF  [C0402]  (hidden comment: Capacitor)
C44  value 100nF  [C0402]  (hidden comment: Capacitor)
C46  value 100nF  [C0402]  (hidden comment: Capacitor)
C47  value 100nF  [C0402]  (hidden comment: Capacitor)
C48  value 100nF  [C0402]  (hidden comment: Capacitor)
C49  value 100nF  [C0402]  (hidden comment: Capacitor)
C55  value 10nF  [C0402]  (hidden comment: Capacitor)
C57  value 100nF  [C0402]  (hidden comment: Capacitor)
C58  value 100nF  [C0402]  (hidden comment: Capacitor)
C59  value 100nF  [C0402]  (hidden comment: Capacitor)
C60  value 2.2uF  [C0201_H0P5]  (hidden comment: Capacitor)
C61  value 100nF  [C0402]  (hidden comment: Capacitor)
C62  value 100nF  [C0402]  (hidden comment: Capacitor)
C63  value 100nF  [C0402]  (hidden comment: Capacitor)
C64  value 2.2uF  [C0201_H0P5]  (hidden comment: Capacitor)
C65  value 100nF  [C0402]  (hidden comment: Capacitor)
C67  value 100nF  [C0402]  (hidden comment: Capacitor)
C68  value 100nF  [C0402]  (hidden comment: Capacitor)
C69  value 100nF  [C0402]  (hidden comment: Capacitor)
C73  value 2.2uF  [C0201_H0P5]  (hidden comment: Capacitor)
C74  value 100nF  [C0402]  (hidden comment: Capacitor)
C75  value 100nF  [C0402]  (hidden comment: Capacitor)
C76  value 100nF  [C0402]  (hidden comment: Capacitor)
C77  value 100nF  [C0402]  (hidden comment: Capacitor)
C78  value 100nF  [C0402]  (hidden comment: Capacitor)
C84  value 100pF  [C0402]  (hidden comment: Capacitor)
CN9  Header 4x1  [CON_SAMTEC_TSW-104-07-G-S]
CN10  value USB_uB_105017-0001  [CON_USBMICROB_MOLEX_105017-0001_H2P90]  (hidden comment: USB_uB_105017.0001)
D1  BAT60JFILM  [DIO_SOD323]
D3  BAT60JFILM  [DIO_SOD323]
LD5  LD_BICOLOR_VCC  [LED_BI-GR_CMD67-22]
R45  value 0R  [R0402]  (hidden comment: Resistor)
R54  value 0R  [R0402]  (hidden comment: Resistor)
R55  value 0R  [R0402]  (hidden comment: Resistor)
R56  value 0R  [R0402]  (hidden comment: Resistor)
R61  value 0R  [R0402]  (hidden comment: Resistor)
R65  value 10K  [R0402]  (hidden comment: Resistor)
R66  value 3K  [R0402]  (hidden comment: Resistor)
R68  value 0R  [R0402]  (hidden comment: Resistor)
R74  value 100R  [R0402]  (hidden comment: Resistor)
R81  value 0R  [R0402]  (hidden comment: Resistor)
R84  value 10K  [R0402]  (hidden comment: Resistor)
R87  value 4K7  [R0402]  (hidden comment: Resistor)
R88  value 0R  [R0402]  (hidden comment: Resistor)
R89  value 4K7  [R0402]  (hidden comment: Resistor)
R90  value 0R  [R0402]  (hidden comment: Resistor)
R91  value 0R  [R0402]  (hidden comment: Resistor)
R94  value 4K7  [R0402]  (hidden comment: Resistor)
R117  value 330R  [R0402]  (hidden comment: Resistor)
R125  value 330R  [R0402]  (hidden comment: Resistor)
TP38  Test Point  [TP_SMD_1MM]  (value not drawn)  (no BOM)
TP39  Test Point  [TP_SMD_1MM]  (value not drawn)  (no BOM)
TP44  Test Point  [TP_SMD_1MM]  (value not drawn)  (no BOM)
TP47  Test Point  [TP_SMD_1MM]  (value not drawn)  (no BOM)
TP48  Test Point  [TP_SMD_1MM]  (value not drawn)  (no BOM)
U11  LD3985M33R  [REG_SOT23-5L]
U12  ST-LINKV3E  [ICC_UFBGA201_176+25_10X10_P065]  (parts A,B,C of 3)
U16  value ESDA7P60-1U1M  [ESD_QFN2_1P6X1_P125]  (hidden comment: ESD-TRANSIL)
U18  ECMF02-2AMX6  [ESD_QFN-6L_1P7X1P5_P050]
X1  value 25MHz  [OSC_NDK_NZ2520SB_4P]  (hidden comment: OSCILLATOR_4_PINS)

### Blocks framed on the sheet
ST-LINKV3E USB HS & 5V USB CHARGER: C84 CN10 U16 U18
3V3 for ST-LINKV3E Only: C36 C41-C44 C55 D1 D3 R45 U11
ST-LINKV3E MCU POWER: C46-C49 C57-C60 C62 C63 C67-C69 C73-C78 R84 U12
ST-LINKV3E Bridges (SPI/I2C/CAN/USART/GPIOs): R56 R91 TP38 TP48 U12
ST-LINKV3E Communication LEDs: LD5 R117 R125
SWD INTERACE: R61 R81 R88 R90 TP39
ST-LINKV3E JTAG/SWD/SWIM Debug Module: C61 C64 C65 CN9 R54 R55 R65 R66 R68 R74 R87 R89 R94 TP44 TP47 U12 X1

### Ports
NRST (bidir), STLINK_JTDI (in), STLINK_SWCLK, STLINK_SWDIO, STLINK_SWO, STLK_VCP1_RX (in), STLK_VCP1_TX (out), STLK_VCP2_RX (in), STLK_VCP2_TX (out)

### Nets
3V3_STLK: C42.2 C43.2 C44.2 C46.2 C47.2 C48.2 C49.2 C57.2 C58.2 C59.2 C61.2 C62.2 C63.2 C67.2 C68.2 C69.2 C74.2 C75.2 C76.2 C77.2 C78.2 CN9.1 LD5.3(YellowGreen_anode) R65.1 R89.1 U11.5(Vout) U12.C1(VBAT) U12.C5(VDD) U12.C6(PDR_ON) U12.C7(VDD) U12.C8(VDD) U12.C9(VDD) U12.F3(VDD) U12.G3(VDD) U12.G13(VDD) U12.H13(VDD) U12.J12(VDD) U12.J13(VDD) U12.K4(VDD) U12.N8(VDD) U12.N9(VDD) U12.N10(VDD) U12.P1(VREF+) U12.R1(VDDA) X1.4(VDD)
5V_USB_CHGR: C84.2 CN10.1(VBUS) D3.1(A) U16.1(IO1)
5V_VIN: D1.1(A)
GND: C36.2 C41.1 C42.1 C43.1 C44.1 C46.1 C47.1 C48.1 C49.1 C55.1 C57.1 C58.1 C59.1 C60.1 C61.1 C62.1 C63.1 C64.1 C65.1 C67.1 C68.1 C69.1 C73.1 C74.1 C75.1 C76.1 C77.1 C78.1 C84.1 CN9.3 CN10.5(GND) CN10.6(Shield) CN10.7(Shield) CN10.8(Shield) CN10.9(Shield) CN10.10(EXP) CN10.11(EXP) LD5.4(RED_cathode) R66.1 R68.2 R74.1 R84.1 R87.1 TP39.1 U11.2(GND) U12.D5(VSS) U12.D6(BOOT0) U12.D7(VSS) U12.D8(VSS) U12.D9(VSS) U12.F2(VSS) U12.F6(VSS) U12.F7(VSS) U12.F8(VSS) U12.F9(VSS) U12.F10(VSS) U12.F12(VSS) U12.G2(VSS) U12.G6(VSS) U12.G7(VSS) U12.G8(VSS) U12.G9(VSS) U12.G10(VSS) U12.G12(VSS) U12.H6(VSS) U12.H7(VSS) U12.H8(VSS) U12.H9(VSS) U12.H10(VSS) U12.H12(VSS) U12.J6(VSS) U12.J7(VSS) U12.J8(VSS) U12.J9(VSS) U12.J10(VSS) U12.K6(VSS) U12.K7(VSS) U12.K8(VSS) U12.K9(VSS) U12.K10(VSS) U12.M1(VSSA) U12.M8(VSS) U12.M9(VSS) U12.N1(VREF-) U16.2(GND) U18.3(GND) X1.2(GND)
VDD: R94.2
GNDDetect: R74.2 U12.K13(GNDDetect/PG5)
NRST: R88.2 ; port NRST
STLINK_SWCLK: R90.2 ; port STLINK_SWCLK
STLINK_SWDIO: R81.2 ; port STLINK_SWDIO
STLINK_SWO: R61.2 ; port STLINK_SWO
STLK_LED: R117.2 R125.2 U12.D15(STLK_LED/PA10)
STLK_RST: C65.2 R68.1 TP44.1 U12.J1(NRST)
STLK_SWCLK: CN9.2 U12.A14(STLK_SWCLK/PA14)
STLK_SWDIO: CN9.4 U12.A15(STLK_SWDIO/PA13)
STLK_VCP1_RX: R55.2 ; port STLK_VCP1_RX
STLK_VCP1_TX: R54.2 ; port STLK_VCP1_TX
STLK_VCP2_RX: R91.1 ; port STLK_VCP2_RX
STLK_VCP2_TX: R56.1 ; port STLK_VCP2_TX
T_JTDI: U12.L3(T_JTDI/PF8) ; port STLINK_JTDI
T_NRST: R88.1 U12.P3(T_NRST/PA6)
T_PWR_EN: TP47.1 U12.R5(T_PWR_EN/PB0)
T_PWR_EXT: R89.2 U12.R4(T_PWR_EXT/PB1)
T_SWCLK: R90.1 U12.A10(T_JRCLK/PB3) U12.M6(T_JCLK_OUT/PB2) U12.M11(T_SWCLK/PH6)
T_SWDIO: R81.1 U12.L2(T_JTMS/T_SWDIO_OUT/PF9) U12.N12(T_SWDIO_IN/PH7)
T_SWO: R61.1 U12.A6(T_JTDO/PB5) U12.D12(T_SWO/PD2)
USB_DEV_HS_CN_N: CN10.2(DM) U18.5(D-)
USB_DEV_HS_CN_P: CN10.3(DP) U18.6(D+)
USB_DEV_HS_N: U12.R14(USB_DEV_HS_N/PB14) U18.2(D-)
USB_DEV_HS_P: U12.R15(USB_DEV_HS_P/PB15) U18.1(D+)
NetC36_1: C36.1 C41.2 R45.2 U11.1(Vin) U11.3(CE)
NetC55_2: C55.2 U11.4(BYPASS)
NetC60_2: C60.2 U12.F13(VCAP2)
NetC64_2: C64.2 U12.J14(V12_OTGPHY)
NetC73_2: C73.2 U12.M10(VCAP1)
NetD1_2: D1.2(K) D3.2(K) R45.1
NetLD5_1: LD5.1(YellowGreen_cathode) R125.1
NetLD5_2: LD5.2(Red_anode) R117.1
NetR54_1: R54.1 U12.A7(STLK_VCP_TX/PG14)
NetR55_1: R55.1 U12.C10(STLK_VCP_RX/PG9)
NetR56_2: R56.2 TP38.1 U12.B14(UART_TX/PC10)
NetR65_2: R65.2 X1.1(EN)
NetR66_2: R66.2 U12.J15(REXT_OTGPHY)
NetR84_2: R84.2 U12.L4(BYPASS-REG)
NetR87_2: R87.2 R94.1 U12.N3(T_VCC_AIN/PA0)
NetR91_2: R91.2 TP48.1 U12.R13(UART_RX/PB11)
NetU12_G1: U12.G1(OSC_IN/PH0) X1.3(OUT)

Not connected (* = marked no-connect by the designer): CN10 4(ID)*; U12 A2(GPIO0/PE2)* A5(I2C_SCL/PB8)* A9(SPI_NSS/PB4)* B1(GPIO1/PE4)* B2(GPIO2/PE5)* B3(GPIO3/PE6)* B4(I2C_SDA/PB9)* B15(CAN_TX/PA12)* C4(HW_TYP_1/PI5)* C15(CAN_RX/PA11)* D4(HW_TYP_0/PI4)* E15(SPI_SCK/PA9)* G14(SWIM_IN_data/PC8)* G15(SWIM_IN_ack/PC7)* M3(SPI_MOSI/PC1)* M4(SPI_MISO/PC2)* N2(SWIM_OUT/PA1)* N6(T_JNRST/PF13)* N13(UART_RTS/PD12)* N14(UART_CTS/PD11)* R3(T_SW_DIR/PA7)*; U18 4(NC)*

### Layout directives
differential pair; rule Impedance Constraint [Min = 85.00    Max = 95.00    ]: USB_DEV_HS_CN_N, USB_DEV_HS_CN_P, USB_DEV_HS_N, USB_DEV_HS_P

### Notes on the sheet
- ST-LINKV3E
- (near CN10) USB STLK
- PF14
- PF15
- PH4
- NRST
- PH5
- Ground for SWD
- (near CN9) Reserved
- PD8
- PD6
- T_VCC / 2
- Title:
- Project:
- Size:
- Revision:
- Variant:
- A3
- -
- Date:
- Reference:
- Sheet:
- of
- (in symbol MCD-00028) USB_Micro-B receptacle
- (in symbol MCD-00086) INH
- (in symbol MCD-01523, part A) JTAG/SWD/SWIM/VCP_V3
- (in symbol MCD-01523, part B) BRIDGE_V3
- (in symbol MCD-01523, part C) POWER_V3
- (in symbol MCD-02629) Red; Green

### Library data of the parts
C36 C43 = MCD-00095: Capacitor, MLCC, 1uF, 25V, X5R, +/-10%, 0402, T=0.5mm; Manufacturer_Part_Number: GRM155R61E105KA12; Manufacturer: MURATA; Part_Preference: Recommended; Order_Code_RS: 846-7287; Component_Country_Of_Origin: Japan; ShowFields: YES; ID: 2772; Internal_Part_Number: MCD-00095; Status: Released; Part_Type: Capacitor; Package: 0402; ComponentLink1URL: http://tunmcdsvn.tun.st.com/Component_Documentation_Library/Trunk/Capacitor/MURATA_GRM_Series; Order_Code_Digikey: 490-10017-1-ND; Order_Code_Farnell: 2218855
C41 C44 C46-C49 C57-C59 C61-C63 C67-C69 C74-C78 = MCD-00006: Capacitor, MLCC, 100nF, 16V, X7R, +/-10%, 0402, T=0.5mm; Manufacturer_Part_Number: CC0402KRX7R7BB104; Manufacturer: YAGEO; Part_Preference: Recommended; Order_Code_RS: 616-9701; Component_Country_Of_Origin: China; ShowFields: YES; ID: 2474; Internal_Part_Number: MCD-00006; Status: Released; Package: 0402; Part_Type: Capacitor; ComponentLink1URL: http://tunmcdsvn.tun.st.com/Component_Documentation_Library/Trunk/Capacitor/YAGEO_X7R_Series; Order_Code_Digikey: 311-1338-1-ND; Order_Code_Farnell: 9402047
C42 = MCD-01356: Capacitor, MLCC, 4.7uF, 6V3, X5R, +/-20%, 0402, T=0.5mm; Manufacturer_Part_Number: GRM155R60J475ME47; Manufacturer: MURATA; Part_Preference: Recommended; Order_Code_RS: 814-5230; Component_Country_Of_Origin: Japan; ShowFields: YES; ID: 3456; Internal_Part_Number: MCD-01356; Status: Released; Part_Type: Capacitor; Package: 0402; ComponentLink1URL: http://tunmcdsvn.tun.st.com/Component_Documentation_Library/Trunk/Capacitor/MURATA_GRM_Series; Order_Code_Digikey: 490-5915-1-ND; Order_Code_Farnell: 2666407
C55 = MCD-02198: Capacitor, MLCC, 10nF, 50V, X7R, +/-10%, 0402, T=0.5mm; Manufacturer_Part_Number: CC0402KRX7R9BB103; Manufacturer: YAGEO; Part_Preference: Recommended; Order_Code_RS: 6169644; Component_Country_Of_Origin: China; ShowFields: YES; ID: 4298; Internal_Part_Number: MCD-02198; Status: Checked; Part_Type: Capacitor; Package: 0402; ComponentLink1URL: http://tunmcdsvn.tun.st.com/Component_Documentation_Library/Trunk/Capacitor/YAGEO_X7R_Series; Order_Code_Digikey: N/A; Order_Code_Farnell: N/A
C60 C64 C73 = MCD-02235: Capacitor, MLCC, 2.2uF, 10V, X5R,+/-10%, 0201, T=0.5mm; Manufacturer_Part_Number: GRM033R61A225KE47D; Manufacturer: MURATA; Part_Preference: Recommended; Order_Code_RS: NA; Component_Country_Of_Origin: Japan; ShowFields: YES; ID: 4335; Internal_Part_Number: MCD-02235; Status: Checked; Part_Type: Capacitor; Package: 0201; ComponentLink1URL: http://tunmcdsvn.tun.st.com/Component_Documentation_Library/Trunk/Capacitor/MURATA_GRM_Series; Order_Code_Digikey: 490-13227-1-ND; Order_Code_Farnell: NA
C65 = MCD-00006: as C102 on sheet USB_TypeC_DRP; Internal_Part_Number: MCD-00006; Status: Released; Part_Type: Capacitor; Package: 0402; ComponentLink1URL: http://tunmcdsvn.tun.st.com/Component_Documentation_Library/Trunk/Capacitor/YAGEO_X7R_Series; Order_Code_Digikey: 311-1338-1-ND; Order_Code_Farnell: 9402047
C84 = MCD-00205: as C221 on sheet USB_TypeC_DRP; Internal_Part_Number: MCD-00205; Status: Released; Part_Type: Capacitor; Package: 0402; ComponentLink1URL: http://tunmcdsvn.tun.st.com/Component_Documentation_Library/Trunk/Capacitor/YAGEO_NP0_Series; Order_Code_Digikey: 311-1024-1-ND; Order_Code_Farnell: 3019226RL; Order_Code_RS: N/A
CN9 = MCD-00029: as CN13 on sheet USB_TypeC_DRP; Internal_Part_Number: MCD-00029; Value: Header 4x1; Status: Released; ComponentLink1URL: http://tunmcdsvn.tun.st.com/Component_Documentation_Library/Trunk/Connector/SAMTEC_TSW_Series/; Order_Code_Digikey: TSW-104-07-G-S-ND; Order_Code_Farnell: 2667450
CN10 = MCD-00028: MicroUSB_TypeB, 5pins, 0.65mm, RA, SMD, T=2.9mm; Manufacturer_Part_Number: 1050170001; Manufacturer: MOLEX; Part_Type: Connector; Part_Preference: Recommended; Order_Code_RS: 848-6764; Component_Country_Of_Origin: Unknown; ShowFields: YES; ID: 2489; Internal_Part_Number: MCD-00028; Status: Released; ComponentLink1URL: http://tunmcdsvn.tun.st.com/Component_Documentation_Library/Trunk/Connector/MOLEX_1050170001/; Order_Code_Digikey: WM1399TR-ND; Order_Code_Farnell: 2293836
D1 D3 = MCD-00034: Manufacturer: STMICROELECTRONICS; Part_Type: Diode; BMS_Part_Number: 9151097; Part_Preference: Recommended; Manufacturer_HQ_COO: EU; Component_Country_Of_Origin: China; ShowFields: YES; ID: 2483; Internal_Part_Number: MCD-00034; Value: BAT60JFILM; Manufacturer_Part_Number: BAT60JFILM; Status: Released; ComponentLink1URL: http://tunmcdsvn.tun.st.com/Component_Datasheet_Library/Trunk/Diodes/STM_Diode_BAT60JFILM-SOD323
LD5 = MCD-02629: LED Bicolor, Green, Red, 4-PLCC; Part_Type: Display; Manufacturer_Part_Number: CMD6722VRVGCTR8; Manufacturer: VISUAL COMMUNICATIONS COMPANY - VCC; Part_Preference: Not recommended; ShowFields: YES; ID: 4735; Internal_Part_Number: MCD-02629; Value: LD_BICOLOR_VCC; Status: Standby; ComponentLink1URL: http://tunmcdsvn.tun.st.com/Component_Documentation_Library/Trunk/Display/VCC_CMD67-22 _Series/; Package: 4-PLCC; Order_Code_Digikey: L628015TR-ND; Order_Code_Farnell: N/A; Order_Code_RS: N/A
R45 R61 R81 R88 R90 = MCD-00052: as R10 on sheet MCP_IO_expander; Internal_Part_Number: MCD-00052; Status: Released; Part_Type: Resistor; Package: 0402; ComponentLink1URL: http://tunmcdsvn.tun.st.com/Component_Documentation_Library/Trunk/Resistor/YAGEO_RC_L_Series; Order_Code_Digikey: 311-0.0JRCT-ND; Order_Code_Farnell: 9232516RL
R54-R56 R68 R91 = MCD-00052: Resistor, 0R, 0402, +/-5%, 1/16W; Manufacturer_Part_Number: RC0402JR-070RL; Manufacturer: YAGEO; Part_Preference: Recommended; Order_Code_RS: 618-5804; Component_Country_Of_Origin: China; ShowFields: YES; ID: 2540; Internal_Part_Number: MCD-00052; Status: Released; Part_Type: Resistor; ComponentLink1URL: http://tunmcdsvn.tun.st.com/Component_Documentation_Library/Trunk/Resistor/YAGEO_RC_L_Series; Package: 0402; Order_Code_Digikey: 311-0.0JRCT-ND; Order_Code_Farnell: 9232516RL
R65 R84 = MCD-00053: as R187 on sheet USB_TypeC_DRP; Internal_Part_Number: MCD-00053; Status: Released; Part_Type: Resistor; Package: 0402; ComponentLink1URL: http://tunmcdsvn.tun.st.com/Component_Documentation_Library/Trunk/Resistor/YAGEO_RC_L_Series; Order_Code_Digikey: 311-10.0KLRCT-ND; Order_Code_Farnell: 9239359; Order_Code_RS: N/A
R66 = MCD-00185: Resistor, 3K, 0402, +/-1%, 1/16W; Manufacturer_Part_Number: RC0402FR-073KL; Manufacturer: YAGEO; Part_Preference: Recommended; Component_Country_Of_Origin: China; ShowFields: YES; ID: 2682; Internal_Part_Number: MCD-00185; Status: Released; Part_Type: Resistor; Package: 0402; ComponentLink1URL: http://tunmcdsvn.tun.st.com/Component_Documentation_Library/Trunk/Resistor/YAGEO_RC_L_Series; Order_Code_Digikey: 311-3KLRCT-ND; Order_Code_Farnell: 1458777; Order_Code_RS: N/A
R74 = MCD-00067: Resistor, 100R, 0402, +/- 1%, 1/16W; Manufacturer_Part_Number: RC0402FR-07100RL; Manufacturer: YAGEO; Part_Preference: Recommended; Component_Country_Of_Origin: China; ShowFields: YES; ID: 2527; Internal_Part_Number: MCD-00067; Status: Released; Part_Type: Resistor; Package: 0402; ComponentLink1URL: http://tunmcdsvn.tun.st.com/Component_Documentation_Library/Trunk/Resistor/YAGEO_RC_L_Series; Order_Code_Digikey: 311-100LRCT-ND; Order_Code_Farnell: 9239111; Order_Code_RS: N/A
R87 R89 R94 = MCD-00065: Resistor, 4K7, 0402, +/-1%, 1/16W; Manufacturer_Part_Number: RC0402FR-074K7L; Manufacturer: YAGEO; Part_Preference: Recommended; Component_Country_Of_Origin: China; ShowFields: YES; ID: 2526; Internal_Part_Number: MCD-00065; Status: Released; Part_Type: Resistor; Package: 0402; ComponentLink1URL: http://tunmcdsvn.tun.st.com/Component_Documentation_Library/Trunk/Resistor/YAGEO_RC_L_Series; Order_Code_Digikey: 311-4.7KLRCT-ND; Order_Code_Farnell: 9239316; Order_Code_RS: N/A
R117 R125 = MCD-00062: Resistor, 330R, 0402, +/-1%, 1/16W; Manufacturer_Part_Number: RC0402FR-07330RL; Manufacturer: YAGEO; Part_Preference: Recommended; Component_Country_Of_Origin: China; ShowFields: YES; ID: 2529; Internal_Part_Number: MCD-00062; Status: Released; Part_Type: Resistor; Package: 0402; ComponentLink1URL: http://tunmcdsvn.tun.st.com/Component_Documentation_Library/Trunk/Resistor/YAGEO_RC_L_Series; Order_Code_Digikey: 311-330LRCT-ND; Order_Code_Farnell: 9239170; Order_Code_RS: N/A
TP38 TP39 TP44 TP47 TP48 = MCD-00074: as TP51 on sheet USB_TypeC_DRP; Internal_Part_Number: MCD-00074; Status: Released; Manufacturer_Part_Number: N/A; Manufacturer: N/A; ComponentLink1URL: http://na; Order_Code_Digikey: N/A; Order_Code_Farnell: N/A; Order_Code_RS: N/A
U11 = MCD-00086: Ultra low drop-low noise BiCMOS voltage, regulators low ESR capacitors compatible; BMS_Part_Number: 9176161; Part_Preference: Recommended; Part_Type: IC; Manufacturer: STMICROELECTRONICS; Manufacturer_HQ_COO: EU; Component_Country_Of_Origin: China; ShowFields: YES; ID: 2506; Internal_Part_Number: MCD-00086; Value: LD3985M33R; Status: Released; Manufacturer_Part_Number: LD3985M33R; ComponentLink1URL: http://tunmcdsvn.tun.st.com/Component_Datasheet_Library/Trunk/IC/STM_LDO_LD3985
U12 = MCD-01523: MCU, Arm Cortex-M7 32-bit MCU, 512KB Flash, 276KB RAM, With Crypto; Part_Type: IC; Manufacturer_Part_Number: STM32F723IEK6; Manufacturer: STMICROELECTRONICS; Part_Preference: Recommended; Manufacturer_HQ_COO: EU; Value: ST-LINKV3S; Component_Country_Of_Origin: Philippines; ShowFields: YES; ID: 3623; Internal_Part_Number: MCD-01523; Package: ICC_UFBGA201_176+25_10X10_P065; ComponentLink1URL: http://tunmcdsvn.tun.st.com/Component_Datasheet_Library/Trunk/IC/BGA176+25L_10x10x0.6_pitch0.65.pdf
U16 = MCD-00251: High power transient voltage suppressor, 7V breakdown; Part_Type: Diode; Manufacturer: STMICROELECTRONICS; BMS_Part_Number: 9179042; Part_Preference: Recommended; Manufacturer_HQ_COO: EU; Component_Country_Of_Origin: China; ShowFields: YES; ID: 2618; Internal_Part_Number: MCD-00251; Status: Released; Manufacturer_Part_Number: ESDA7P60-1U1M; ComponentLink1URL: http://tunmcdsvn.tun.st.com/Component_Datasheet_Library/Trunk/Diodes/STM_ESD_ESDA7P60-1U1M
U18 = MCD-00649: as U32 on sheet USB_TypeC_DRP; Internal_Part_Number: MCD-00649; Value: ECMF02-2AMX6; Status: Released; Manufacturer_Part_Number: ECMF02-2AMX6; ComponentLink1URL: http://tunmcdsvn.tun.st.com/Component_Datasheet_Library/Trunk/Diodes/STM_ESD_ECMF02-2AMX6
X1 = MCD-00597: Oscillator, SPXO, 25Mhz, +/-50ppm, 3V3, square wave, 2.5x2mm; Manufacturer_Part_Number: NZ2520SH-25MHZ-END4869C; Manufacturer: NDK; Part_Type: Crystal_Osc; BMS_Part_Number: 9157050; Part_Preference: Recommended; Component_Country_Of_Origin: Unknown; ShowFields: YES; ID: 3148; Internal_Part_Number: MCD-00597; Status: Released; ComponentLink1URL: http://tunmcdsvn.tun.st.com/Component_Documentation_Library/Trunk/Crytal_Oscillator/NDK_NZ2520SH_Series; Package: 2.5x2mm; Order_Code_Digikey: N/A; Order_Code_Farnell: N/A; Order_Code_RS: N/A